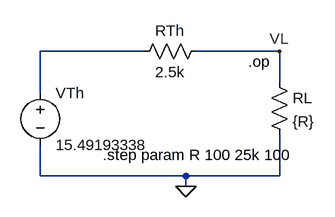
[diagram p0: schematic 21101298_CSE250_2(ii).asc]
21101298_CSE250_2(ii).asc, the LTspice schematic file:
Version 4
SHEET 1 880 680
WIRE 144 48 -16 48
WIRE 352 48 224 48
WIRE 352 96 352 48
WIRE -16 112 -16 48
WIRE -16 240 -16 192
WIRE 208 240 -16 240
WIRE 352 240 352 176
WIRE 352 240 208 240
WIRE 208 256 208 240
FLAG 208 256 0
FLAG 352 48 VL
SYMBOL voltage -16 96 R0
WINDOW 123 0 0 Left 0
WINDOW 39 0 0 Left 0
SYMATTR InstName VTh
SYMATTR Value 15.49193338
SYMBOL res 128 64 R270
WINDOW 0 32 56 VTop 2
WINDOW 3 0 56 VBottom 2
SYMATTR InstName RTh
SYMATTR Value 2.5k
SYMBOL res 336 80 R0
SYMATTR InstName RL
SYMATTR Value {R}
TEXT 80 208 Left 2 !.step param R 100 25k 100
TEXT 304 64 Left 2 !.op

The netlist it stands for:
* 21101298_CSE250_2(ii).asc
VTh N001 0 15.49193338
RTh N001 VL 2.5k
RL VL 0 {R}
.step param R 100 25k 100
.op
.backanno
.end